# Altium schematic sheet TSSOP-8 Adaptor.SCHDOC
size B
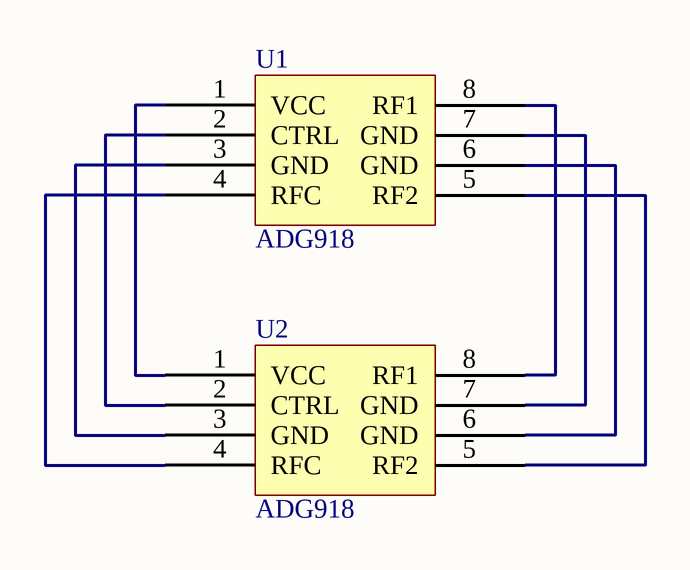
[diagram p0: TSSOP-8 Adaptor.SCHDOC]

## Parts
U1  ADG918  [SSO-G8/P.65]
U2  ADG918  [dip-8]

## Nets
NetU1_1: U1.1(VCC) U2.1(VCC)
NetU1_2: U1.2(CTRL) U2.2(CTRL)
NetU1_3: U1.3(GND) U2.3(GND)
NetU1_4: U1.4(RFC) U2.4(RFC)
NetU1_5: U1.5(RF2) U2.5(RF2)
NetU1_6: U1.6(GND) U2.6(GND)
NetU1_7: U1.7(GND) U2.7(GND)
NetU1_8: U1.8(RF1) U2.8(RF1)